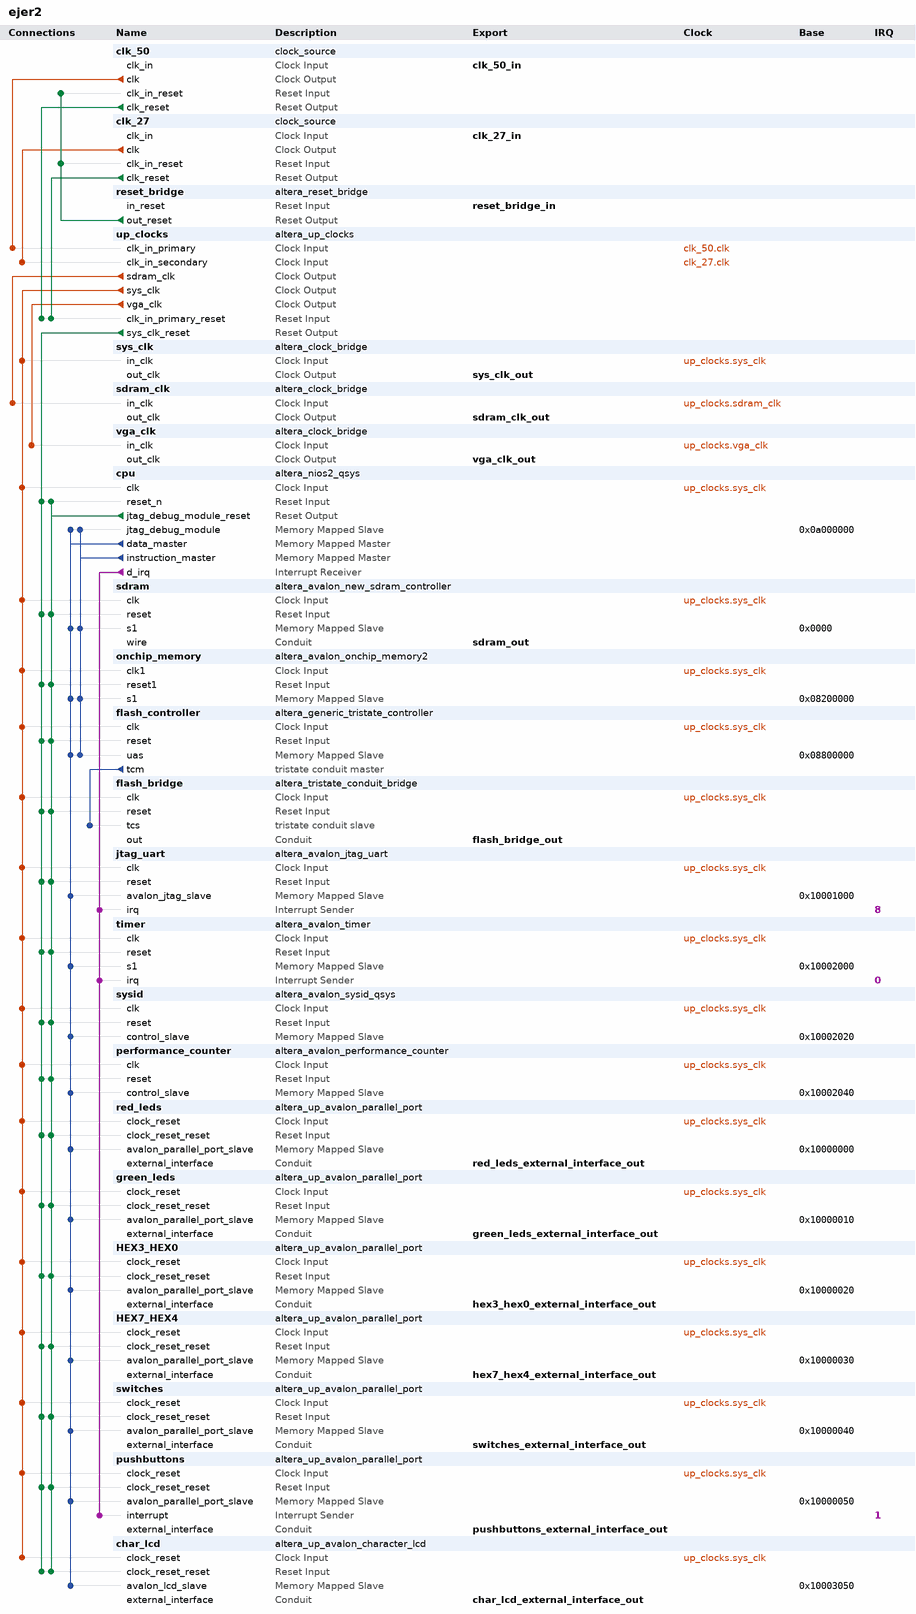
[diagram p0: system contents]
# Platform Designer (Qsys) system ejer2, Cyclone IV E EP4CE115F29C7
# Parameters at their usual value, and those the tool derives, are not listed.
package require -exact qsys 13.0
create_system ejer2
set_project_property DEVICE_FAMILY {Cyclone IV E}
set_project_property DEVICE EP4CE115F29C7

add_instance clk_50 clock_source 13.0
set_instance_parameter_value clk_50 clockFrequency 50000000

add_instance clk_27 clock_source 13.0
set_instance_parameter_value clk_27 clockFrequency 27000000

add_instance reset_bridge altera_reset_bridge 13.0
set_instance_parameter_value reset_bridge ACTIVE_LOW_RESET 1
set_instance_parameter_value reset_bridge SYNCHRONOUS_EDGES none

add_instance up_clocks altera_up_clocks 13.0
set_instance_parameter_value up_clocks board DE2-115
set_instance_parameter_value up_clocks vga_clk true
set_instance_parameter_value up_clocks audio_clk true
set_instance_parameter_value up_clocks audio_clk_freq 12.288

add_instance sys_clk altera_clock_bridge 13.0
set_instance_parameter_value sys_clk DERIVED_CLOCK_RATE 50000000
set_instance_parameter_value sys_clk EXPLICIT_CLOCK_RATE 0

add_instance sdram_clk altera_clock_bridge 13.0
set_instance_parameter_value sdram_clk DERIVED_CLOCK_RATE 50000000
set_instance_parameter_value sdram_clk EXPLICIT_CLOCK_RATE 0

add_instance vga_clk altera_clock_bridge 13.0
set_instance_parameter_value vga_clk DERIVED_CLOCK_RATE 25000000
set_instance_parameter_value vga_clk EXPLICIT_CLOCK_RATE 0

add_instance cpu altera_nios2_qsys 13.0
set_instance_parameter_value cpu resetSlave sdram.s1
set_instance_parameter_value cpu mmu_TLBMissExcSlave None
set_instance_parameter_value cpu exceptionSlave sdram.s1
set_instance_parameter_value cpu breakSlave cpu.jtag_debug_module
set_instance_parameter_value cpu impl Small
set_instance_parameter_value cpu icache_size 4096
set_instance_parameter_value cpu debug_level Level2

add_instance sdram altera_avalon_new_sdram_controller 13.0.1.99.2
set_instance_parameter_value sdram TAC 5.5
set_instance_parameter_value sdram TRCD 20.0
set_instance_parameter_value sdram TRP 20.0
set_instance_parameter_value sdram casLatency 3
set_instance_parameter_value sdram columnWidth 10
set_instance_parameter_value sdram dataWidth 32
set_instance_parameter_value sdram generateSimulationModel true
set_instance_parameter_value sdram model single_Micron_MT48LC4M32B2_7_chip
set_instance_parameter_value sdram numberOfBanks 4
set_instance_parameter_value sdram numberOfChipSelects 1
set_instance_parameter_value sdram powerUpDelay 100.0
set_instance_parameter_value sdram refreshPeriod 15.625
set_instance_parameter_value sdram rowWidth 13

add_instance onchip_memory altera_avalon_onchip_memory2 13.0.1.99.2
set_instance_parameter_value onchip_memory dataWidth 32
set_instance_parameter_value onchip_memory dualPort false
set_instance_parameter_value onchip_memory initMemContent true
set_instance_parameter_value onchip_memory initializationFileName onchip_mem.hex
set_instance_parameter_value onchip_memory memorySize 32768

add_instance flash_controller altera_generic_tristate_controller 13.0
set_instance_parameter_value flash_controller TCM_ADDRESS_W 23
set_instance_parameter_value flash_controller TCM_DATA_W 8
set_instance_parameter_value flash_controller TCM_BYTEENABLE_W 1
set_instance_parameter_value flash_controller TCM_READ_WAIT 160
set_instance_parameter_value flash_controller TCM_WRITE_WAIT 160
set_instance_parameter_value flash_controller TCM_SETUP_WAIT 60
set_instance_parameter_value flash_controller TCM_DATA_HOLD 60
set_instance_parameter_value flash_controller TCM_MAX_PENDING_READ_TRANSACTIONS 3
set_instance_parameter_value flash_controller TCM_TURNAROUND_TIME 2
set_instance_parameter_value flash_controller TCM_TIMING_UNITS 0
set_instance_parameter_value flash_controller TCM_READLATENCY 2
set_instance_parameter_value flash_controller TCM_SYMBOLS_PER_WORD 1
set_instance_parameter_value flash_controller USE_READ 1
set_instance_parameter_value flash_controller USE_BEGINTRANSFER 0
set_instance_parameter_value flash_controller USE_BYTEENABLE 0
set_instance_parameter_value flash_controller USE_OUTPUTENABLE 0
set_instance_parameter_value flash_controller ACTIVE_LOW_READ 0
set_instance_parameter_value flash_controller ACTIVE_LOW_WRITE 0
set_instance_parameter_value flash_controller ACTIVE_LOW_CHIPSELECT 0
set_instance_parameter_value flash_controller ACTIVE_LOW_BYTEENABLE 0
set_instance_parameter_value flash_controller ACTIVE_LOW_OUTPUTENABLE 0
set_instance_parameter_value flash_controller ACTIVE_LOW_BEGINTRANSFER 0
set_instance_parameter_value flash_controller CHIPSELECT_THROUGH_READLATENCY 0
set_instance_parameter_value flash_controller MODULE_ASSIGNMENT_KEYS embeddedsw.configuration.hwClassnameDriverSupportList,embeddedsw.CMacro.SIZE
set_instance_parameter_value flash_controller MODULE_ASSIGNMENT_VALUES "altera_avalon_lan91c111\\,altera_avalon_cfi_flash,8388608u"

add_instance flash_bridge altera_tristate_conduit_bridge 13.0

add_instance jtag_uart altera_avalon_jtag_uart 13.0.1.99.2
set_instance_parameter_value jtag_uart simInteractiveOptions NO_INTERACTIVE_WINDOWS

add_instance timer altera_avalon_timer 13.0.1.99.2
set_instance_parameter_value timer period 125
set_instance_parameter_value timer periodUnits MSEC

add_instance sysid altera_avalon_sysid_qsys 13.0
set_instance_parameter_value sysid id 0

add_instance performance_counter altera_avalon_performance_counter 13.0.1.99.2
set_instance_parameter_value performance_counter numberOfSections 3

add_instance red_leds altera_up_avalon_parallel_port 13.0
set_instance_parameter_value red_leds board DE2-115
set_instance_parameter_value red_leds preset LEDs
set_instance_parameter_value red_leds leds Red
set_instance_parameter_value red_leds capture false
set_instance_parameter_value red_leds edge Rising
set_instance_parameter_value red_leds irq false

add_instance green_leds altera_up_avalon_parallel_port 13.0
set_instance_parameter_value green_leds board DE2-115
set_instance_parameter_value green_leds preset LEDs
set_instance_parameter_value green_leds capture false
set_instance_parameter_value green_leds edge Rising
set_instance_parameter_value green_leds irq false

add_instance HEX3_HEX0 altera_up_avalon_parallel_port 13.0
set_instance_parameter_value HEX3_HEX0 board DE2-115
set_instance_parameter_value HEX3_HEX0 preset {Seven Segment Displays}
set_instance_parameter_value HEX3_HEX0 capture false
set_instance_parameter_value HEX3_HEX0 edge Rising
set_instance_parameter_value HEX3_HEX0 irq false

add_instance HEX7_HEX4 altera_up_avalon_parallel_port 13.0
set_instance_parameter_value HEX7_HEX4 board DE2-115
set_instance_parameter_value HEX7_HEX4 preset {Seven Segment Displays}
set_instance_parameter_value HEX7_HEX4 sevensegs {7 to 4}
set_instance_parameter_value HEX7_HEX4 capture false
set_instance_parameter_value HEX7_HEX4 edge Rising
set_instance_parameter_value HEX7_HEX4 irq false

add_instance switches altera_up_avalon_parallel_port 13.0
set_instance_parameter_value switches board DE2-115
set_instance_parameter_value switches preset {Slider Switches}
set_instance_parameter_value switches capture false
set_instance_parameter_value switches edge Rising
set_instance_parameter_value switches irq false

add_instance pushbuttons altera_up_avalon_parallel_port 13.0
set_instance_parameter_value pushbuttons board DE2-115
set_instance_parameter_value pushbuttons preset Pushbuttons
set_instance_parameter_value pushbuttons capture true
set_instance_parameter_value pushbuttons edge Falling
set_instance_parameter_value pushbuttons irq true

add_instance char_lcd altera_up_avalon_character_lcd 13.0
set_instance_parameter_value char_lcd cursor Both

# connections
add_connection clk_27.clk up_clocks.clk_in_secondary clock
add_connection clk_50.clk up_clocks.clk_in_primary clock
add_connection up_clocks.sdram_clk sdram_clk.in_clk clock
add_connection up_clocks.sys_clk char_lcd.clock_reset clock
add_connection up_clocks.sys_clk cpu.clk clock
add_connection up_clocks.sys_clk flash_bridge.clk clock
add_connection up_clocks.sys_clk flash_controller.clk clock
add_connection up_clocks.sys_clk green_leds.clock_reset clock
add_connection up_clocks.sys_clk HEX3_HEX0.clock_reset clock
add_connection up_clocks.sys_clk HEX7_HEX4.clock_reset clock
add_connection up_clocks.sys_clk jtag_uart.clk clock
add_connection up_clocks.sys_clk onchip_memory.clk1 clock
add_connection up_clocks.sys_clk performance_counter.clk clock
add_connection up_clocks.sys_clk pushbuttons.clock_reset clock
add_connection up_clocks.sys_clk red_leds.clock_reset clock
add_connection up_clocks.sys_clk sdram.clk clock
add_connection up_clocks.sys_clk switches.clock_reset clock
add_connection up_clocks.sys_clk sys_clk.in_clk clock
add_connection up_clocks.sys_clk sysid.clk clock
add_connection up_clocks.sys_clk timer.clk clock
add_connection up_clocks.vga_clk vga_clk.in_clk clock
add_connection clk_27.clk_reset up_clocks.clk_in_primary_reset reset
add_connection clk_50.clk_reset up_clocks.clk_in_primary_reset reset
add_connection cpu.jtag_debug_module_reset char_lcd.clock_reset_reset reset
add_connection cpu.jtag_debug_module_reset cpu.reset_n reset
add_connection cpu.jtag_debug_module_reset flash_bridge.reset reset
add_connection cpu.jtag_debug_module_reset flash_controller.reset reset
add_connection cpu.jtag_debug_module_reset green_leds.clock_reset_reset reset
add_connection cpu.jtag_debug_module_reset HEX3_HEX0.clock_reset_reset reset
add_connection cpu.jtag_debug_module_reset HEX7_HEX4.clock_reset_reset reset
add_connection cpu.jtag_debug_module_reset jtag_uart.reset reset
add_connection cpu.jtag_debug_module_reset onchip_memory.reset1 reset
add_connection cpu.jtag_debug_module_reset performance_counter.reset reset
add_connection cpu.jtag_debug_module_reset pushbuttons.clock_reset_reset reset
add_connection cpu.jtag_debug_module_reset red_leds.clock_reset_reset reset
add_connection cpu.jtag_debug_module_reset sdram.reset reset
add_connection cpu.jtag_debug_module_reset switches.clock_reset_reset reset
add_connection cpu.jtag_debug_module_reset sysid.reset reset
add_connection cpu.jtag_debug_module_reset timer.reset reset
add_connection reset_bridge.out_reset clk_27.clk_in_reset reset
add_connection reset_bridge.out_reset clk_50.clk_in_reset reset
add_connection up_clocks.sys_clk_reset char_lcd.clock_reset_reset reset
add_connection up_clocks.sys_clk_reset cpu.reset_n reset
add_connection up_clocks.sys_clk_reset flash_bridge.reset reset
add_connection up_clocks.sys_clk_reset flash_controller.reset reset
add_connection up_clocks.sys_clk_reset green_leds.clock_reset_reset reset
add_connection up_clocks.sys_clk_reset HEX3_HEX0.clock_reset_reset reset
add_connection up_clocks.sys_clk_reset HEX7_HEX4.clock_reset_reset reset
add_connection up_clocks.sys_clk_reset jtag_uart.reset reset
add_connection up_clocks.sys_clk_reset onchip_memory.reset1 reset
add_connection up_clocks.sys_clk_reset performance_counter.reset reset
add_connection up_clocks.sys_clk_reset pushbuttons.clock_reset_reset reset
add_connection up_clocks.sys_clk_reset red_leds.clock_reset_reset reset
add_connection up_clocks.sys_clk_reset sdram.reset reset
add_connection up_clocks.sys_clk_reset switches.clock_reset_reset reset
add_connection up_clocks.sys_clk_reset sysid.reset reset
add_connection up_clocks.sys_clk_reset timer.reset reset
add_connection cpu.data_master char_lcd.avalon_lcd_slave avalon
set_connection_parameter_value cpu.data_master/char_lcd.avalon_lcd_slave baseAddress 0x10003050
add_connection cpu.data_master cpu.jtag_debug_module avalon
set_connection_parameter_value cpu.data_master/cpu.jtag_debug_module baseAddress 0x0a000000
add_connection cpu.data_master flash_controller.uas avalon
set_connection_parameter_value cpu.data_master/flash_controller.uas baseAddress 0x08800000
add_connection cpu.data_master green_leds.avalon_parallel_port_slave avalon
set_connection_parameter_value cpu.data_master/green_leds.avalon_parallel_port_slave baseAddress 0x10000010
add_connection cpu.data_master HEX3_HEX0.avalon_parallel_port_slave avalon
set_connection_parameter_value cpu.data_master/HEX3_HEX0.avalon_parallel_port_slave baseAddress 0x10000020
add_connection cpu.data_master HEX7_HEX4.avalon_parallel_port_slave avalon
set_connection_parameter_value cpu.data_master/HEX7_HEX4.avalon_parallel_port_slave baseAddress 0x10000030
add_connection cpu.data_master jtag_uart.avalon_jtag_slave avalon
set_connection_parameter_value cpu.data_master/jtag_uart.avalon_jtag_slave baseAddress 0x10001000
add_connection cpu.data_master onchip_memory.s1 avalon
set_connection_parameter_value cpu.data_master/onchip_memory.s1 baseAddress 0x08200000
add_connection cpu.data_master performance_counter.control_slave avalon
set_connection_parameter_value cpu.data_master/performance_counter.control_slave baseAddress 0x10002040
add_connection cpu.data_master pushbuttons.avalon_parallel_port_slave avalon
set_connection_parameter_value cpu.data_master/pushbuttons.avalon_parallel_port_slave baseAddress 0x10000050
add_connection cpu.data_master red_leds.avalon_parallel_port_slave avalon
set_connection_parameter_value cpu.data_master/red_leds.avalon_parallel_port_slave baseAddress 0x10000000
add_connection cpu.data_master sdram.s1 avalon
set_connection_parameter_value cpu.data_master/sdram.s1 baseAddress 0x0000
add_connection cpu.data_master switches.avalon_parallel_port_slave avalon
set_connection_parameter_value cpu.data_master/switches.avalon_parallel_port_slave baseAddress 0x10000040
add_connection cpu.data_master sysid.control_slave avalon
set_connection_parameter_value cpu.data_master/sysid.control_slave baseAddress 0x10002020
add_connection cpu.data_master timer.s1 avalon
set_connection_parameter_value cpu.data_master/timer.s1 baseAddress 0x10002000
add_connection cpu.instruction_master cpu.jtag_debug_module avalon
set_connection_parameter_value cpu.instruction_master/cpu.jtag_debug_module baseAddress 0x0a000000
add_connection cpu.instruction_master flash_controller.uas avalon
set_connection_parameter_value cpu.instruction_master/flash_controller.uas baseAddress 0x08800000
add_connection cpu.instruction_master onchip_memory.s1 avalon
set_connection_parameter_value cpu.instruction_master/onchip_memory.s1 baseAddress 0x08200000
add_connection cpu.instruction_master sdram.s1 avalon
set_connection_parameter_value cpu.instruction_master/sdram.s1 baseAddress 0x0000
add_connection cpu.d_irq jtag_uart.irq interrupt
set_connection_parameter_value cpu.d_irq/jtag_uart.irq irqNumber 8
add_connection cpu.d_irq pushbuttons.interrupt interrupt
set_connection_parameter_value cpu.d_irq/pushbuttons.interrupt irqNumber 1
add_connection cpu.d_irq timer.irq interrupt
set_connection_parameter_value cpu.d_irq/timer.irq irqNumber 0
add_connection flash_controller.tcm flash_bridge.tcs tristate_conduit

# exported interfaces
add_interface clk_50_in clock sink
set_interface_property clk_50_in EXPORT_OF clk_50.clk_in
add_interface clk_27_in clock sink
set_interface_property clk_27_in EXPORT_OF clk_27.clk_in
add_interface reset_bridge_in reset sink
set_interface_property reset_bridge_in EXPORT_OF reset_bridge.in_reset
add_interface sys_clk_out clock source
set_interface_property sys_clk_out EXPORT_OF sys_clk.out_clk
add_interface sdram_clk_out clock source
set_interface_property sdram_clk_out EXPORT_OF sdram_clk.out_clk
add_interface vga_clk_out clock source
set_interface_property vga_clk_out EXPORT_OF vga_clk.out_clk
add_interface sdram_out conduit end
set_interface_property sdram_out EXPORT_OF sdram.wire
add_interface flash_bridge_out conduit end
set_interface_property flash_bridge_out EXPORT_OF flash_bridge.out
add_interface red_leds_external_interface_out conduit end
set_interface_property red_leds_external_interface_out EXPORT_OF red_leds.external_interface
add_interface green_leds_external_interface_out conduit end
set_interface_property green_leds_external_interface_out EXPORT_OF green_leds.external_interface
add_interface hex3_hex0_external_interface_out conduit end
set_interface_property hex3_hex0_external_interface_out EXPORT_OF HEX3_HEX0.external_interface
add_interface hex7_hex4_external_interface_out conduit end
set_interface_property hex7_hex4_external_interface_out EXPORT_OF HEX7_HEX4.external_interface
add_interface switches_external_interface_out conduit end
set_interface_property switches_external_interface_out EXPORT_OF switches.external_interface
add_interface pushbuttons_external_interface_out conduit end
set_interface_property pushbuttons_external_interface_out EXPORT_OF pushbuttons.external_interface
add_interface char_lcd_external_interface_out conduit end
set_interface_property char_lcd_external_interface_out EXPORT_OF char_lcd.external_interface

set_interconnect_requirement {$system} qsys_mm.clockCrossingAdapter HANDSHAKE
set_interconnect_requirement {$system} qsys_mm.maxAdditionalLatency 1

save_system ejer2.qsys
